# Altium schematic sheet 3xInputs.SchDoc
size A4; SheetNumber: 4; SheetTotal: 6
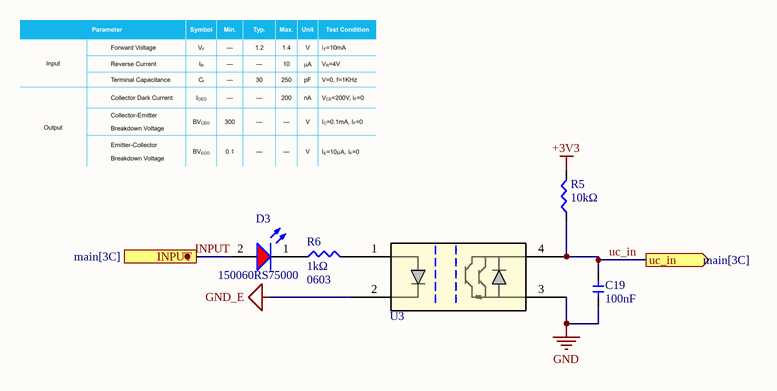
[diagram p0: 3xInputs.SchDoc]

## Parts
C19  value 100nF  [0603_cap]  (hidden comment: 0603_100nF)
D3  150060RS75000  [WL-SMCW_0603_150060xx75000]
R5  value 10kΩ  [0603-smd]  (hidden comment: 0603_10K)
R6  value 1kΩ  Package: 0603  [0603-smd]  (hidden comment: 0603_1K)
U3  LTV-352T  [IC4_LTV-352T_LTO-M]  (value not drawn)

## Ports
INPUT (in, see main[3C]), uc_in (out, see main[3C])

## Nets
+3V3: R5.2
GND: C19.1 U3.3
GND_E: U3.2
INPUT: D3.2(A) ; port INPUT
uc_in: C19.2 R5.1 U3.4 ; port uc_in
NetD3_1: D3.1(K) R6.1
NetR6_2: R6.2 U3.1

## Notes on the sheet
- Title:
- Drawn By:
- Page Contents:
- Size:
- Date:
- License:
- Email:
- A4
- Number:
- Time:
- Revision:
- Sheet
- of

## Library data of the parts
C19 = 0603_100nF: Volt: V; Package: 0603
D3 = CMP-1426-00001-3: NexarPartId: 29717776; Color: Red; Power Dissipation: 72mW; Max Reverse Voltage (DC): 5V; Peak Wavelength: 630nm; Viewing Angle: 140°; Forward Voltage: 2V; Luminous Intensity: 250mcd; Forward Current: 100mA; Dominant Wavelength: 625nm; Lens Style: Clear, Rectangular; Max Junction Temperature (Tj): 95°C; Test Current: 20mA; Mount: Surface Mount; Packaging: Tape and Reel; Case Code (Metric): 1608; Max Operating Temperature: 85°C; Case Code (Imperial): 0603; REACH SVHC: Unknown; Width: 800µm; Length: 1.6mm; Reverse Voltage: 5V; Height: 700µm; Case/Package: 0603; RoHS: Compliant; Wavelength: 625nm; Min Operating Temperature: -40°C
R5 = 0603_10K: Power: W; Package: 0603
R6 = 0603_1K: Power: W
U3 = LTV-352T: LTV Series Single Channel 300V 3750 Vrms Transistor Output Optocoupler SMT DIP-4; Mfr_Name: LITE-ON; Manufacturer: Vishay Lite-On; RefDes: RefDes; Type: Type; Supplier 1: Rs; Manufacturer Part Number: LTV-352T; RoHS: Yes; Category: Optocouplers; Stock 1: 22730; Pricing 1: 25=0,29, 50=0,278, 250=0,228, 500=0,2 (GBP); ComponentLink1URL: https://datasheet.ciiva.com/11772/0900766b80de6aef-11772096.pdf?src-supplier=Rs; ComponentLink1Description: https://datasheet.ciiva.com/11772/0900766b80de6aef-11772096.pdf?src-supplier=Rs; ComponentLink2URL: https://datasheet.ciiva.com/2086/ltv-352t-2086258.pdf?src-supplier=Digikey; ComponentLink2Description: https://datasheet.ciiva.com/2086/ltv-352t-2086258.pdf?src-supplier=Digikey; ComponentLink3URL: https://datasheet.ciiva.com/19471/1260710-19471302.pdf?src-supplier=Jameco; ComponentLink3Description: https://datasheet.ciiva.com/19471/1260710-19471302.pdf?src-supplier=Jameco; ComponentLink4URL: https://datasheet.ciiva.com/15118/getdatasheetpartid-145582-15118811.pdf?src-supplier=Verical; ComponentLink4Description: https://datasheet.ciiva.com/15118/getdatasheetpartid-145582-15118811.pdf?src-supplier=Verical; ComponentLink5URL: https://datasheet.ciiva.com/2086/s-110-ltv-352t20140520-2086259.pdf?src-supplier=Digikey; ComponentLink5Description: https://datasheet.ciiva.com/2086/s-110-ltv-352t20140520-2086259.pdf?src-supplier=Digikey; ComponentLink6URL: https://datasheet.ciiva.com/2086/s-110-ltv-352t20140520-2086260.pdf?src-supplier=Digikey; ComponentLink6Description: https://datasheet.ciiva.com/2086/s-110-ltv-352t20140520-2086260.pdf?src-supplier=Digikey; Supplier Part Number 1: 6912063P